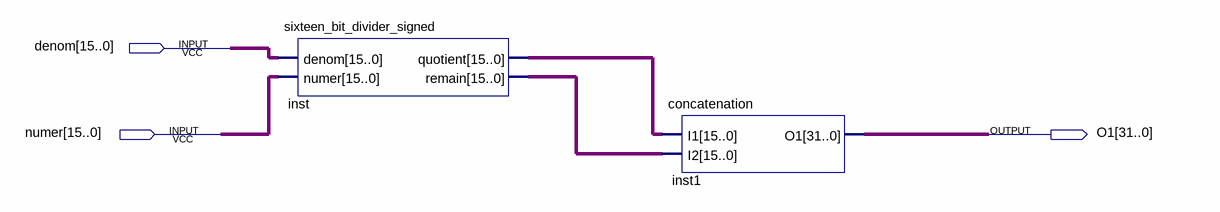
[diagram p0: schematic sheet]
// Quartus schematic sixteen_bit_divider_signed_O1.bdf as structural Verilog: 2 symbols, 3 pins
module sixteen_bit_divider_signed_O1 (
  input  [15:0] denom,
  input  [15:0] numer,
  output [31:0] O1
);

  wire [15:0] inst_quotient, inst_remain;

  sixteen_bit_divider_signed inst (.denom(denom), .numer(numer), .quotient(inst_quotient), .remain(inst_remain));
  concatenation inst1 (.I1(inst_quotient), .I2(inst_remain), .O1(O1));
endmodule
